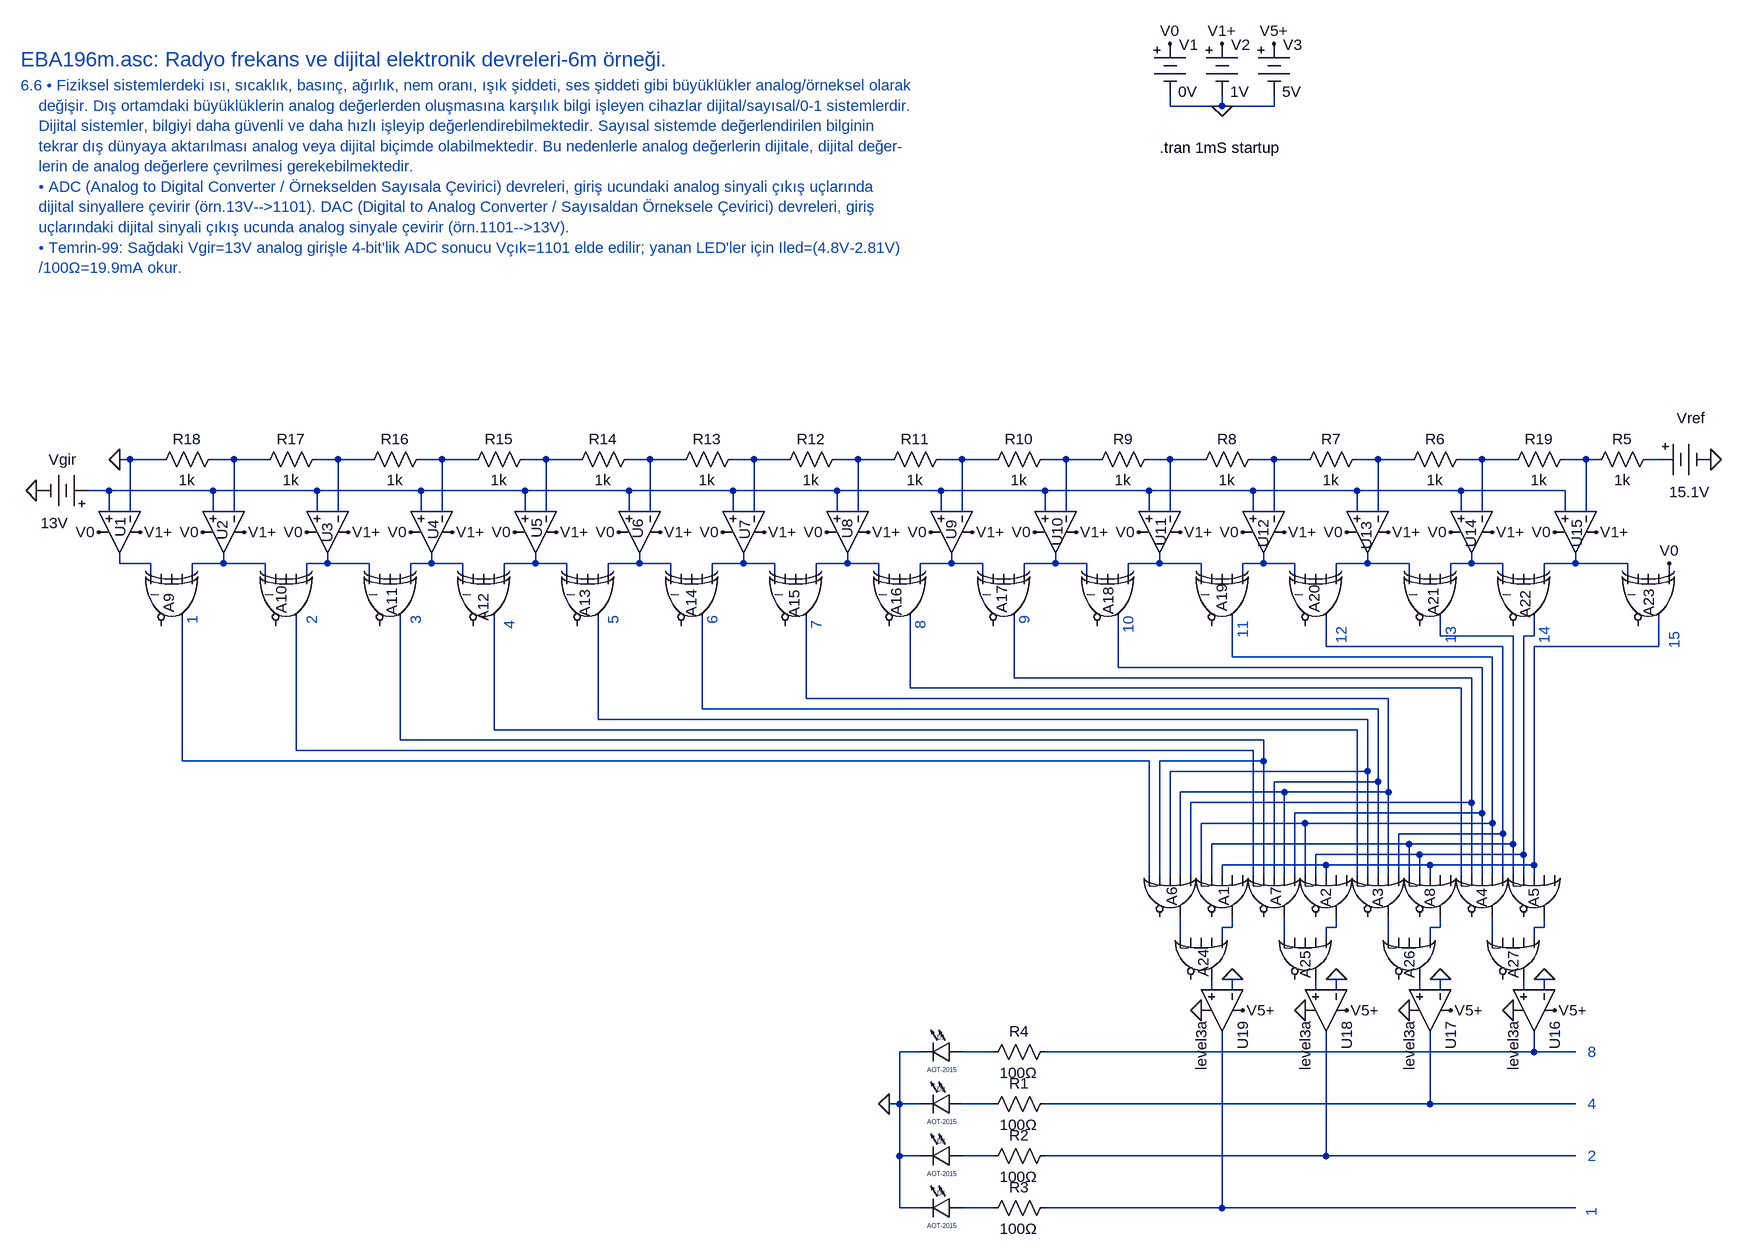
[diagram p0: schematic EBA196m.asc]
EBA196m.asc, the LTspice schematic file:
Version 4
SHEET 1 7064 4332
WIRE 1536 128 1536 112
WIRE 1616 128 1616 112
WIRE 1616 128 1536 128
WIRE 1696 128 1696 112
WIRE 1696 128 1616 128
WIRE -64 672 -80 672
WIRE -16 672 -64 672
WIRE 96 672 64 672
WIRE 144 672 96 672
WIRE 256 672 224 672
WIRE 304 672 256 672
WIRE 416 672 384 672
WIRE 464 672 416 672
WIRE 576 672 544 672
WIRE 624 672 576 672
WIRE 736 672 704 672
WIRE 784 672 736 672
WIRE 896 672 864 672
WIRE 944 672 896 672
WIRE 1056 672 1024 672
WIRE 1104 672 1056 672
WIRE 1216 672 1184 672
WIRE 1264 672 1216 672
WIRE 1376 672 1344 672
WIRE 1424 672 1376 672
WIRE 1536 672 1504 672
WIRE 1584 672 1536 672
WIRE 1696 672 1664 672
WIRE 1744 672 1696 672
WIRE 1856 672 1824 672
WIRE 1904 672 1856 672
WIRE 2016 672 1984 672
WIRE 2064 672 2016 672
WIRE 2176 672 2144 672
WIRE 2192 672 2176 672
WIRE 2288 672 2272 672
WIRE -96 720 -128 720
WIRE 64 720 -96 720
WIRE 224 720 64 720
WIRE 384 720 224 720
WIRE 544 720 384 720
WIRE 704 720 544 720
WIRE 864 720 704 720
WIRE 1024 720 864 720
WIRE 1184 720 1024 720
WIRE 1344 720 1184 720
WIRE 1504 720 1344 720
WIRE 1664 720 1504 720
WIRE 1824 720 1664 720
WIRE 1984 720 1824 720
WIRE 2144 720 1984 720
WIRE -96 752 -96 720
WIRE -64 752 -64 672
WIRE 64 752 64 720
WIRE 96 752 96 672
WIRE 224 752 224 720
WIRE 256 752 256 672
WIRE 384 752 384 720
WIRE 416 752 416 672
WIRE 544 752 544 720
WIRE 576 752 576 672
WIRE 704 752 704 720
WIRE 736 752 736 672
WIRE 864 752 864 720
WIRE 896 752 896 672
WIRE 1024 752 1024 720
WIRE 1056 752 1056 672
WIRE 1184 752 1184 720
WIRE 1216 752 1216 672
WIRE 1344 752 1344 720
WIRE 1376 752 1376 672
WIRE 1504 752 1504 720
WIRE 1536 752 1536 672
WIRE 1664 752 1664 720
WIRE 1696 752 1696 672
WIRE 1824 752 1824 720
WIRE 1856 752 1856 672
WIRE 1984 752 1984 720
WIRE 2016 752 2016 672
WIRE 2144 752 2144 720
WIRE 2176 752 2176 672
WIRE -80 832 -80 816
WIRE -32 832 -80 832
WIRE 80 832 80 816
WIRE 80 832 32 832
WIRE 144 832 80 832
WIRE 240 832 240 816
WIRE 240 832 208 832
WIRE 304 832 240 832
WIRE 400 832 400 816
WIRE 400 832 368 832
WIRE 448 832 400 832
WIRE 560 832 560 816
WIRE 560 832 512 832
WIRE 608 832 560 832
WIRE 720 832 720 816
WIRE 720 832 672 832
WIRE 768 832 720 832
WIRE 880 832 880 816
WIRE 880 832 832 832
WIRE 928 832 880 832
WIRE 1040 832 1040 816
WIRE 1040 832 992 832
WIRE 1088 832 1040 832
WIRE 1200 832 1200 816
WIRE 1200 832 1152 832
WIRE 1248 832 1200 832
WIRE 1360 832 1360 816
WIRE 1360 832 1312 832
WIRE 1408 832 1360 832
WIRE 1520 832 1520 816
WIRE 1520 832 1472 832
WIRE 1584 832 1520 832
WIRE 1680 832 1680 816
WIRE 1680 832 1648 832
WIRE 1728 832 1680 832
WIRE 1840 832 1840 816
WIRE 1840 832 1792 832
WIRE 1904 832 1840 832
WIRE 2000 832 2000 816
WIRE 2000 832 1968 832
WIRE 2048 832 2000 832
WIRE 2160 832 2160 816
WIRE 2160 832 2112 832
WIRE 2240 832 2160 832
WIRE -32 848 -32 832
WIRE 32 848 32 832
WIRE 144 848 144 832
WIRE 208 848 208 832
WIRE 304 848 304 832
WIRE 368 848 368 832
WIRE 448 848 448 832
WIRE 512 848 512 832
WIRE 608 848 608 832
WIRE 672 848 672 832
WIRE 768 848 768 832
WIRE 832 848 832 832
WIRE 928 848 928 832
WIRE 992 848 992 832
WIRE 1088 848 1088 832
WIRE 1152 848 1152 832
WIRE 1248 848 1248 832
WIRE 1312 848 1312 832
WIRE 1408 848 1408 832
WIRE 1472 848 1472 832
WIRE 1584 848 1584 832
WIRE 1648 848 1648 832
WIRE 1728 848 1728 832
WIRE 1792 848 1792 832
WIRE 1904 848 1904 832
WIRE 1968 848 1968 832
WIRE 2048 848 2048 832
WIRE 2112 848 2112 832
WIRE 2240 848 2240 832
WIRE 2304 848 2304 832
WIRE 1952 944 1952 912
WIRE 2064 944 1952 944
WIRE 2096 944 2096 912
WIRE 2096 944 2080 944
WIRE 1776 960 1776 912
WIRE 2048 960 1776 960
WIRE 2288 960 2288 912
WIRE 2288 960 2096 960
WIRE 1632 976 1632 912
WIRE 2032 976 1632 976
WIRE 1456 992 1456 912
WIRE 2016 992 1456 992
WIRE 1296 1008 1296 912
WIRE 2000 1008 1296 1008
WIRE 1136 1024 1136 912
WIRE 1984 1024 1136 1024
WIRE 976 1040 976 912
WIRE 1872 1040 976 1040
WIRE 816 1056 816 912
WIRE 1856 1056 816 1056
WIRE 656 1072 656 912
WIRE 1840 1072 656 1072
WIRE 496 1088 496 912
WIRE 1824 1088 496 1088
WIRE 352 1104 352 912
WIRE 1680 1104 352 1104
WIRE 192 1120 192 912
WIRE 1664 1120 192 1120
WIRE 16 1136 16 912
WIRE 1504 1136 16 1136
WIRE 1680 1136 1680 1104
WIRE 1680 1136 1520 1136
WIRE 1840 1152 1840 1072
WIRE 1840 1152 1536 1152
WIRE 1856 1168 1856 1056
WIRE 1856 1168 1696 1168
WIRE 1712 1184 1552 1184
WIRE 1872 1184 1872 1040
WIRE 1872 1184 1712 1184
WIRE 2000 1200 2000 1008
WIRE 2000 1200 1568 1200
WIRE 2016 1216 2016 992
WIRE 2016 1216 1728 1216
WIRE 1744 1232 1584 1232
WIRE 2032 1232 2032 976
WIRE 2032 1232 1744 1232
WIRE 2048 1248 2048 960
WIRE 2048 1248 1888 1248
WIRE 1904 1264 1600 1264
WIRE 2064 1264 2064 944
WIRE 2064 1264 1904 1264
WIRE 1920 1280 1760 1280
WIRE 2080 1280 2080 944
WIRE 2080 1280 1920 1280
WIRE 1776 1296 1616 1296
WIRE 1936 1296 1776 1296
WIRE 2096 1296 2096 960
WIRE 2096 1296 1936 1296
WIRE 1504 1312 1504 1136
WIRE 1520 1312 1520 1136
WIRE 1536 1312 1536 1152
WIRE 1552 1312 1552 1184
WIRE 1568 1312 1568 1200
WIRE 1584 1312 1584 1232
WIRE 1600 1312 1600 1264
WIRE 1616 1312 1616 1296
WIRE 1664 1312 1664 1120
WIRE 1680 1312 1680 1136
WIRE 1696 1312 1696 1168
WIRE 1712 1312 1712 1184
WIRE 1728 1312 1728 1216
WIRE 1744 1312 1744 1232
WIRE 1760 1312 1760 1280
WIRE 1776 1312 1776 1296
WIRE 1824 1312 1824 1088
WIRE 1840 1312 1840 1152
WIRE 1856 1312 1856 1168
WIRE 1872 1312 1872 1184
WIRE 1888 1312 1888 1248
WIRE 1904 1312 1904 1264
WIRE 1920 1312 1920 1280
WIRE 1936 1312 1936 1296
WIRE 1984 1312 1984 1024
WIRE 2000 1312 2000 1200
WIRE 2016 1312 2016 1216
WIRE 2032 1312 2032 1232
WIRE 2048 1312 2048 1248
WIRE 2064 1312 2064 1264
WIRE 2080 1312 2080 1280
WIRE 2096 1312 2096 1296
WIRE 1632 1392 1632 1376
WIRE 1632 1392 1616 1392
WIRE 1792 1392 1792 1376
WIRE 1792 1392 1776 1392
WIRE 1952 1392 1952 1376
WIRE 1952 1392 1936 1392
WIRE 2112 1392 2112 1376
WIRE 2112 1392 2096 1392
WIRE 1552 1408 1552 1376
WIRE 1616 1408 1616 1392
WIRE 1712 1408 1712 1376
WIRE 1776 1408 1776 1392
WIRE 1872 1408 1872 1376
WIRE 1936 1408 1936 1392
WIRE 2032 1408 2032 1376
WIRE 2096 1408 2096 1392
WIRE 1600 1488 1600 1472
WIRE 1632 1488 1632 1472
WIRE 1760 1488 1760 1472
WIRE 1792 1488 1792 1472
WIRE 1920 1488 1920 1472
WIRE 1952 1488 1952 1472
WIRE 2080 1488 2080 1472
WIRE 2112 1488 2112 1472
WIRE 1152 1584 1120 1584
WIRE 1264 1584 1216 1584
WIRE 2096 1584 2096 1552
WIRE 2096 1584 1344 1584
WIRE 2160 1584 2096 1584
WIRE 1120 1664 1120 1584
WIRE 1120 1664 1104 1664
WIRE 1152 1664 1120 1664
WIRE 1264 1664 1216 1664
WIRE 1936 1664 1936 1552
WIRE 1936 1664 1344 1664
WIRE 2160 1664 1936 1664
WIRE 1120 1744 1120 1664
WIRE 1152 1744 1120 1744
WIRE 1264 1744 1216 1744
WIRE 1776 1744 1776 1552
WIRE 1776 1744 1344 1744
WIRE 2160 1744 1776 1744
WIRE 1120 1824 1120 1744
WIRE 1152 1824 1120 1824
WIRE 1264 1824 1216 1824
WIRE 1616 1824 1616 1552
WIRE 1616 1824 1344 1824
WIRE 2160 1824 1616 1824
FLAG 1616 32 V1+
FLAG 1616 128 0
FLAG 1536 32 V0
FLAG 1696 32 V5+
FLAG 1104 1664 0
FLAG -80 672 0
FLAG 2368 672 0
FLAG -208 720 0
FLAG -112 784 V0
FLAG 48 784 V0
FLAG 208 784 V0
FLAG 368 784 V0
FLAG 528 784 V0
FLAG 688 784 V0
FLAG 848 784 V0
FLAG 1008 784 V0
FLAG 1168 784 V0
FLAG 1328 784 V0
FLAG 1488 784 V0
FLAG 1648 784 V0
FLAG 1808 784 V0
FLAG 1968 784 V0
FLAG 2128 784 V0
FLAG 2192 784 V1+
FLAG 2032 784 V1+
FLAG 1872 784 V1+
FLAG 1712 784 V1+
FLAG 1552 784 V1+
FLAG 1392 784 V1+
FLAG 1232 784 V1+
FLAG 1072 784 V1+
FLAG 912 784 V1+
FLAG 752 784 V1+
FLAG 592 784 V1+
FLAG 432 784 V1+
FLAG 272 784 V1+
FLAG 112 784 V1+
FLAG -48 784 V1+
FLAG 2304 832 V0
FLAG 2064 1520 0
FLAG 1904 1520 0
FLAG 1744 1520 0
FLAG 1584 1520 0
FLAG 2128 1520 V5+
FLAG 1968 1520 V5+
FLAG 1808 1520 V5+
FLAG 1648 1520 V5+
FLAG 2112 1472 0
FLAG 1952 1472 0
FLAG 1792 1472 0
FLAG 1632 1472 0
SYMBOL Misc\\battery 1616 16 R0
WINDOW 0 14 18 Left 2
WINDOW 3 13 90 Left 2
SYMATTR InstName V2
SYMATTR Value 1V
SYMBOL Misc\\battery 1536 16 R0
WINDOW 0 14 18 Left 2
WINDOW 3 13 90 Left 2
SYMATTR InstName V1
SYMATTR Value 0V
SYMBOL Misc\\battery 1696 16 R0
WINDOW 0 14 18 Left 2
WINDOW 3 13 90 Left 2
SYMATTR InstName V3
SYMATTR Value 5V
SYMBOL res 1360 1648 R90
WINDOW 0 0 56 VBottom 2
WINDOW 3 32 56 VTop 2
SYMATTR InstName R1
SYMATTR Value 100Ω
SYMBOL res 1360 1728 R90
WINDOW 0 0 56 VBottom 2
WINDOW 3 32 56 VTop 2
SYMATTR InstName R2
SYMATTR Value 100Ω
SYMBOL res 1360 1808 R90
WINDOW 0 0 56 VBottom 2
WINDOW 3 32 56 VTop 2
SYMATTR InstName R3
SYMATTR Value 100Ω
SYMBOL res 1360 1568 R90
WINDOW 0 0 56 VBottom 2
WINDOW 3 32 56 VTop 2
SYMATTR InstName R4
SYMATTR Value 100Ω
SYMBOL Digital\\or 1680 1344 R90
WINDOW 0 -14 61 Left 2
SYMATTR InstName A1
SYMBOL Digital\\or 1840 1344 R90
WINDOW 0 -12 64 Left 2
SYMATTR InstName A2
SYMBOL Digital\\or 1920 1344 R90
WINDOW 0 -12 64 Left 2
SYMATTR InstName A3
SYMBOL Digital\\or 2080 1344 R90
WINDOW 0 -12 64 Left 2
SYMATTR InstName A4
SYMBOL Digital\\or 2160 1344 R90
WINDOW 0 -12 64 Left 2
SYMATTR InstName A5
SYMBOL Digital\\or 1600 1344 R90
WINDOW 0 -14 61 Left 2
SYMATTR InstName A6
SYMBOL Digital\\or 1760 1344 R90
WINDOW 0 -14 61 Left 2
SYMATTR InstName A7
SYMBOL Digital\\or 2000 1344 R90
WINDOW 0 -12 64 Left 2
SYMATTR InstName A8
SYMBOL res 2288 656 R90
WINDOW 0 0 56 VBottom 2
WINDOW 3 32 56 VTop 2
SYMATTR InstName R5
SYMATTR Value 1k
SYMBOL res 2000 656 R90
WINDOW 0 0 56 VBottom 2
WINDOW 3 32 56 VTop 2
SYMATTR InstName R6
SYMATTR Value 1k
SYMBOL res 1840 656 R90
WINDOW 0 0 56 VBottom 2
WINDOW 3 32 56 VTop 2
SYMATTR InstName R7
SYMATTR Value 1k
SYMBOL res 1680 656 R90
WINDOW 0 0 56 VBottom 2
WINDOW 3 32 56 VTop 2
SYMATTR InstName R8
SYMATTR Value 1k
SYMBOL res 1520 656 R90
WINDOW 0 0 56 VBottom 2
WINDOW 3 32 56 VTop 2
SYMATTR InstName R9
SYMATTR Value 1k
SYMBOL res 1360 656 R90
WINDOW 0 0 56 VBottom 2
WINDOW 3 32 56 VTop 2
SYMATTR InstName R10
SYMATTR Value 1k
SYMBOL res 1200 656 R90
WINDOW 0 0 56 VBottom 2
WINDOW 3 32 56 VTop 2
SYMATTR InstName R11
SYMATTR Value 1k
SYMBOL res 1040 656 R90
WINDOW 0 0 56 VBottom 2
WINDOW 3 32 56 VTop 2
SYMATTR InstName R12
SYMATTR Value 1k
SYMBOL res 880 656 R90
WINDOW 0 0 56 VBottom 2
WINDOW 3 32 56 VTop 2
SYMATTR InstName R13
SYMATTR Value 1k
SYMBOL res 720 656 R90
WINDOW 0 0 56 VBottom 2
WINDOW 3 32 56 VTop 2
SYMATTR InstName R14
SYMATTR Value 1k
SYMBOL res 560 656 R90
WINDOW 0 0 56 VBottom 2
WINDOW 3 32 56 VTop 2
SYMATTR InstName R15
SYMATTR Value 1k
SYMBOL res 400 656 R90
WINDOW 0 0 56 VBottom 2
WINDOW 3 32 56 VTop 2
SYMATTR InstName R16
SYMATTR Value 1k
SYMBOL res 240 656 R90
WINDOW 0 0 56 VBottom 2
WINDOW 3 32 56 VTop 2
SYMATTR InstName R17
SYMATTR Value 1k
SYMBOL res 80 656 R90
WINDOW 0 0 56 VBottom 2
WINDOW 3 32 56 VTop 2
SYMATTR InstName R18
SYMATTR Value 1k
SYMBOL Misc\\battery 2272 672 M90
WINDOW 0 -64 88 VLeft 2
WINDOW 3 50 95 VLeft 2
WINDOW 123 0 0 Left 0
WINDOW 39 0 0 Left 0
SYMATTR InstName Vref
SYMATTR Value 15.1V
SYMBOL res 2160 656 R90
WINDOW 0 0 56 VBottom 2
WINDOW 3 32 56 VTop 2
SYMATTR InstName R19
SYMATTR Value 1k
SYMBOL Misc\\battery -112 720 M270
WINDOW 0 32 56 VTop 2
WINDOW 3 -34 68 VBottom 2
WINDOW 123 0 0 Left 0
WINDOW 39 0 0 Left 0
SYMATTR InstName Vgir
SYMATTR Value 13V
SYMBOL OpAmps\\UniversalOpAmp -80 784 R90
WINDOW 0 -23 -1 Left 2
SYMATTR InstName U1
SYMBOL OpAmps\\UniversalOpAmp 80 784 R90
WINDOW 0 -18 2 Left 2
SYMATTR InstName U2
SYMBOL OpAmps\\UniversalOpAmp 240 784 R90
WINDOW 0 -14 0 Left 2
SYMATTR InstName U3
SYMBOL OpAmps\\UniversalOpAmp 400 784 R90
WINDOW 0 -19 -3 Left 2
SYMATTR InstName U4
SYMBOL OpAmps\\UniversalOpAmp 560 784 R90
WINDOW 0 -21 -2 Left 2
SYMATTR InstName U5
SYMBOL OpAmps\\UniversalOpAmp 720 784 R90
WINDOW 0 -20 3 Left 2
SYMATTR InstName U6
SYMBOL OpAmps\\UniversalOpAmp 880 784 R90
WINDOW 0 -19 -2 Left 2
SYMATTR InstName U7
SYMBOL OpAmps\\UniversalOpAmp 1040 784 R90
WINDOW 0 -20 0 Left 2
SYMATTR InstName U8
SYMBOL OpAmps\\UniversalOpAmp 1200 784 R90
WINDOW 0 -19 0 Left 2
SYMATTR InstName U9
SYMBOL OpAmps\\UniversalOpAmp 1360 784 R90
WINDOW 0 -23 -3 Left 2
SYMATTR InstName U10
SYMBOL OpAmps\\UniversalOpAmp 1520 784 R90
WINDOW 0 -23 -2 Left 2
SYMATTR InstName U11
SYMBOL OpAmps\\UniversalOpAmp 1680 784 R90
WINDOW 0 -20 0 Left 2
SYMATTR InstName U12
SYMBOL OpAmps\\UniversalOpAmp 1840 784 R90
WINDOW 0 -17 2 Left 2
SYMATTR InstName U13
SYMBOL OpAmps\\UniversalOpAmp 2000 784 R90
WINDOW 0 -20 1 Left 2
SYMATTR InstName U14
SYMBOL OpAmps\\UniversalOpAmp 2160 784 R90
WINDOW 0 -20 -2 Left 2
SYMATTR InstName U15
SYMBOL Digital\\xor 64 896 R90
WINDOW 0 -18 68 Left 2
SYMATTR InstName A9
SYMBOL Digital\\xor 240 896 R90
WINDOW 0 -29 71 Left 2
SYMATTR InstName A10
SYMBOL Digital\\xor 400 896 R90
WINDOW 0 -26 61 Left 2
SYMATTR InstName A11
SYMBOL Digital\\xor 544 896 R90
WINDOW 0 -18 64 Left 2
SYMATTR InstName A12
SYMBOL Digital\\xor 704 896 R90
WINDOW 0 -24 68 Left 2
SYMATTR InstName A13
SYMBOL Digital\\xor 864 896 R90
WINDOW 0 -24 64 Left 2
SYMATTR InstName A14
SYMBOL Digital\\xor 1024 896 R90
WINDOW 0 -23 66 Left 2
SYMATTR InstName A15
SYMBOL Digital\\xor 1184 896 R90
WINDOW 0 -26 69 Left 2
SYMATTR InstName A16
SYMBOL Digital\\xor 1344 896 R90
WINDOW 0 -30 67 Left 2
SYMATTR InstName A17
SYMBOL Digital\\xor 1504 896 R90
WINDOW 0 -28 63 Left 2
SYMATTR InstName A18
SYMBOL Digital\\xor 1680 896 R90
WINDOW 0 -32 64 Left 2
SYMATTR InstName A19
SYMBOL Digital\\xor 1824 896 R90
WINDOW 0 -31 66 Left 2
SYMATTR InstName A20
SYMBOL Digital\\xor 2000 896 R90
WINDOW 0 -26 59 Left 2
SYMATTR InstName A21
SYMBOL Digital\\xor 2144 896 R90
WINDOW 0 -22 61 Left 2
SYMATTR InstName A22
SYMBOL Digital\\xor 2336 896 R90
WINDOW 0 -25 63 Left 2
SYMATTR InstName A23
SYMBOL Digital\\or 1648 1440 R90
WINDOW 0 -14 61 Left 2
SYMATTR InstName A24
SYMBOL Digital\\or 1808 1440 R90
WINDOW 0 -12 64 Left 2
SYMATTR InstName A25
SYMBOL Digital\\or 1968 1440 R90
WINDOW 0 -12 64 Left 2
SYMATTR InstName A26
SYMBOL Digital\\or 2128 1440 R90
WINDOW 0 -12 64 Left 2
SYMATTR InstName A27
SYMBOL LED 1216 1568 R90
WINDOW 0 0 32 VBottom 0
WINDOW 3 37 30 VTop 0
SYMATTR InstName D1
SYMATTR Value AOT-2015
SYMATTR Description Diode
SYMATTR Type diode
SYMBOL LED 1216 1648 R90
WINDOW 0 0 32 VBottom 0
WINDOW 3 37 30 VTop 0
SYMATTR InstName D2
SYMATTR Value AOT-2015
SYMATTR Description Diode
SYMATTR Type diode
SYMBOL LED 1216 1728 R90
WINDOW 0 0 32 VBottom 0
WINDOW 3 37 30 VTop 0
SYMATTR InstName D3
SYMATTR Value AOT-2015
SYMATTR Description Diode
SYMATTR Type diode
SYMBOL LED 1216 1808 R90
WINDOW 0 0 32 VBottom 0
WINDOW 3 37 30 VTop 0
SYMATTR InstName D4
SYMATTR Value AOT-2015
SYMATTR Description Diode
SYMATTR Type diode
SYMBOL OpAmps\\UniversalOpAmp3 2096 1520 R90
SYMATTR InstName U16
SYMBOL OpAmps\\UniversalOpAmp3 1936 1520 R90
SYMATTR InstName U17
SYMBOL OpAmps\\UniversalOpAmp3 1776 1520 R90
SYMATTR InstName U18
SYMBOL OpAmps\\UniversalOpAmp3 1616 1520 R90
SYMATTR InstName U19
TEXT -232 56 Left 3 ;EBA196m.asc: Radyo frekans ve dijital elektronik devreleri-6m örneği.
TEXT -232 96 Left 2 ;6.6 • Fiziksel sistemlerdeki ısı, sıcaklık, basınç, ağırlık, nem oranı, ışık şiddeti, ses şiddeti gibi büyüklükler analog/örneksel olarak \n    değişir. Dış ortamdaki büyüklüklerin analog değerlerden oluşmasına karşılık bilgi işleyen cihazlar dijital/sayısal/0-1 sistemlerdir. \n    Dijital sistemler, bilgiyi daha güvenli ve daha hızlı işleyip değerlendirebilmektedir. Sayısal sistemde değerlendirilen bilginin \n    tekrar dış dünyaya aktarılması analog veya dijital biçimde olabilmektedir. Bu nedenlerle analog değerlerin dijitale, dijital değer-\n    lerin de analog değerlere çevrilmesi gerekebilmektedir.\n    • ADC (Analog to Digital Converter / Örnekselden Sayısala Çevirici) devreleri, giriş ucundaki analog sinyali çıkış uçlarında \n    dijital sinyallere çevirir (örn.13V-->1101). DAC (Digital to Analog Converter / Sayısaldan Örneksele Çevirici) devreleri, giriş \n    uçlarındaki dijital sinyali çıkış ucunda analog sinyale çevirir (örn.1101-->13V).\n    • Temrin-99: Sağdaki Vgir=13V analog girişle 4-bit'lik ADC sonucu Vçık=1101 elde edilir; yanan LED'ler için Iled=(4.8V-2.81V)\n    /100Ω=19.9mA okur.
TEXT 1520 192 Left 2 !.tran 1mS startup
TEXT 2184 1824 VRight 2 ;1
TEXT 2192 1744 Right 2 ;2
TEXT 2192 1664 Right 2 ;4
TEXT 2192 1584 Right 2 ;8
TEXT 32 912 VRight 2 ;1
TEXT 216 912 VRight 2 ;2
TEXT 520 920 VRight 2 ;4
TEXT 1152 920 VRight 2 ;8
TEXT 376 912 VRight 2 ;3
TEXT 680 912 VRight 2 ;5
TEXT 832 912 VRight 2 ;6
TEXT 992 920 VRight 2 ;7
TEXT 1312 912 VRight 2 ;9
TEXT 1472 912 VRight 2 ;10
TEXT 1648 920 VRight 2 ;11
TEXT 1800 928 VRight 2 ;12
TEXT 1968 928 VRight 2 ;13
TEXT 2112 928 VRight 2 ;14
TEXT 2312 936 VRight 2 ;15

The netlist it stands for:
* EBA196m.asc
V2 V1+ 0 1V
V1 V0 0 0V
V3 V5+ 0 5V
R1 N062 N061 100Ω
R2 N064 N063 100Ω
R3 N066 N065 100Ω
R4 N060 N059 100Ω
A1 0 0 N035 N032 N036 0 N047 0 OR
A2 0 0 N035 N033 N036 0 N048 0 OR
A3 N034 N040 N041 N042 N043 0 N053 0 OR
A4 N034 N036 N037 N038 N039 0 N054 0 OR
A5 0 0 N035 N033 N032 0 N050 0 OR
A6 N038 N040 N042 N044 N046 0 N051 0 OR
A7 N037 N040 N041 N044 N045 0 N052 0 OR
A8 0 0 N035 N033 N032 0 N049 0 OR
R5 N015 N014 1k
R6 N013 N012 1k
R7 N012 N011 1k
R8 N011 N010 1k
R9 N010 N009 1k
R10 N009 N008 1k
R11 N008 N007 1k
R12 N007 N006 1k
R13 N006 N005 1k
R14 N005 N004 1k
R15 N004 N003 1k
R16 N003 N002 1k
R17 N002 N001 1k
R18 N001 0 1k
Vref N015 0 15.1V
R19 N014 N013 1k
Vgir N016 0 13V
XU1 N016 0 V1+ V0 N017 level1 Avol=1Meg GBW=10Meg Vos=0 En=0 Enk=0 In=0 Ink=0 Rin=500Meg  ; pins In+ In- V+ V- OUT
XU2 N016 N001 V1+ V0 N018 level1 Avol=1Meg GBW=10Meg Vos=0 En=0 Enk=0 In=0 Ink=0 Rin=500Meg  ; pins In+ In- V+ V- OUT
XU3 N016 N002 V1+ V0 N019 level1 Avol=1Meg GBW=10Meg Vos=0 En=0 Enk=0 In=0 Ink=0 Rin=500Meg  ; pins In+ In- V+ V- OUT
XU4 N016 N003 V1+ V0 N020 level1 Avol=1Meg GBW=10Meg Vos=0 En=0 Enk=0 In=0 Ink=0 Rin=500Meg  ; pins In+ In- V+ V- OUT
XU5 N016 N004 V1+ V0 N021 level1 Avol=1Meg GBW=10Meg Vos=0 En=0 Enk=0 In=0 Ink=0 Rin=500Meg  ; pins In+ In- V+ V- OUT
XU6 N016 N005 V1+ V0 N022 level1 Avol=1Meg GBW=10Meg Vos=0 En=0 Enk=0 In=0 Ink=0 Rin=500Meg  ; pins In+ In- V+ V- OUT
XU7 N016 N006 V1+ V0 N023 level1 Avol=1Meg GBW=10Meg Vos=0 En=0 Enk=0 In=0 Ink=0 Rin=500Meg  ; pins In+ In- V+ V- OUT
XU8 N016 N007 V1+ V0 N024 level1 Avol=1Meg GBW=10Meg Vos=0 En=0 Enk=0 In=0 Ink=0 Rin=500Meg  ; pins In+ In- V+ V- OUT
XU9 N016 N008 V1+ V0 N025 level1 Avol=1Meg GBW=10Meg Vos=0 En=0 Enk=0 In=0 Ink=0 Rin=500Meg  ; pins In+ In- V+ V- OUT
XU10 N016 N009 V1+ V0 N026 level1 Avol=1Meg GBW=10Meg Vos=0 En=0 Enk=0 In=0 Ink=0 Rin=500Meg  ; pins In+ In- V+ V- OUT
XU11 N016 N010 V1+ V0 N027 level1 Avol=1Meg GBW=10Meg Vos=0 En=0 Enk=0 In=0 Ink=0 Rin=500Meg  ; pins In+ In- V+ V- OUT
XU12 N016 N011 V1+ V0 N028 level1 Avol=1Meg GBW=10Meg Vos=0 En=0 Enk=0 In=0 Ink=0 Rin=500Meg  ; pins In+ In- V+ V- OUT
XU13 N016 N012 V1+ V0 N029 level1 Avol=1Meg GBW=10Meg Vos=0 En=0 Enk=0 In=0 Ink=0 Rin=500Meg  ; pins In+ In- V+ V- OUT
XU14 N016 N013 V1+ V0 N030 level1 Avol=1Meg GBW=10Meg Vos=0 En=0 Enk=0 In=0 Ink=0 Rin=500Meg  ; pins In+ In- V+ V- OUT
XU15 N016 N014 V1+ V0 N031 level1 Avol=1Meg GBW=10Meg Vos=0 En=0 Enk=0 In=0 Ink=0 Rin=500Meg  ; pins In+ In- V+ V- OUT
A9 N018 0 0 0 N017 0 N046 0 XOR
A10 N019 0 0 0 N018 0 N045 0 XOR
A11 N020 0 0 0 N019 0 N044 0 XOR
A12 N021 0 0 0 N020 0 N043 0 XOR
A13 N022 0 0 0 N021 0 N042 0 XOR
A14 N023 0 0 0 N022 0 N041 0 XOR
A15 N024 0 0 0 N023 0 N040 0 XOR
A16 N025 0 0 0 N024 0 N039 0 XOR
A17 N026 0 0 0 N025 0 N038 0 XOR
A18 N027 0 0 0 N026 0 N037 0 XOR
A19 N028 0 0 0 N027 0 N036 0 XOR
A20 N029 0 0 0 N028 0 N034 0 XOR
A21 N030 0 0 0 N029 0 N032 0 XOR
A22 N031 0 0 0 N030 0 N033 0 XOR
A23 V0 0 0 0 N031 0 N035 0 XOR
A24 N047 0 0 0 N051 0 N055 0 OR
A25 N048 0 0 0 N052 0 N056 0 OR
A26 N049 0 0 0 N053 0 N057 0 OR
A27 N050 0 0 0 N054 0 N058 0 OR
D1 N059 0 AOT-2015
D2 N061 0 AOT-2015
D3 N063 0 AOT-2015
D4 N065 0 AOT-2015
XU16 N058 0 V5+ 0 N060 level3a  ; pins In+ In- V+ V- OUT
XU17 N057 0 V5+ 0 N062 level3a  ; pins In+ In- V+ V- OUT
XU18 N056 0 V5+ 0 N064 level3a  ; pins In+ In- V+ V- OUT
XU19 N055 0 V5+ 0 N066 level3a  ; pins In+ In- V+ V- OUT
.model D D
.lib standard.dio
* EBA196m.asc: Radyo frekans ve dijital elektronik devreleri-6m örneği.
* 6.6 • Fiziksel sistemlerdeki ısı, sıcaklık, basınç, ağırlık, nem oranı, ışık şiddeti, ses şiddeti gibi büyüklükler analog/örneksel olarak
*     değişir. Dış ortamdaki büyüklüklerin analog değerlerden oluşmasına karşılık bilgi işleyen cihazlar dijital/sayısal/0-1 sistemlerdir.
*     Dijital sistemler, bilgiyi daha güvenli ve daha hızlı işleyip değerlendirebilmektedir. Sayısal sistemde değerlendirilen bilginin
*     tekrar dış dünyaya aktarılması analog veya dijital biçimde olabilmektedir. Bu nedenlerle analog değerlerin dijitale, dijital değer-
*     lerin de analog değerlere çevrilmesi gerekebilmektedir.
*     • ADC (Analog to Digital Converter / Örnekselden Sayısala Çevirici) devreleri, giriş ucundaki analog sinyali çıkış uçlarında
*     dijital sinyallere çevirir (örn.13V-->1101). DAC (Digital to Analog Converter / Sayısaldan Örneksele Çevirici) devreleri, giriş
*     uçlarındaki dijital sinyali çıkış ucunda analog sinyale çevirir (örn.1101-->13V).
*     • Temrin-99: Sağdaki Vgir=13V analog girişle 4-bit'lik ADC sonucu Vçık=1101 elde edilir; yanan LED'ler için Iled=(4.8V-2.81V)
*     /100Ω=19.9mA okur.
.tran 1mS startup
* 1
* 2
* 4
* 8
* 1
* 2
* 4
* 8
* 3
* 5
* 6
* 7
* 9
* 10
* 11
* 12
* 13
* 14
* 15
.lib UniversalOpAmp1.lib
.backanno
.end